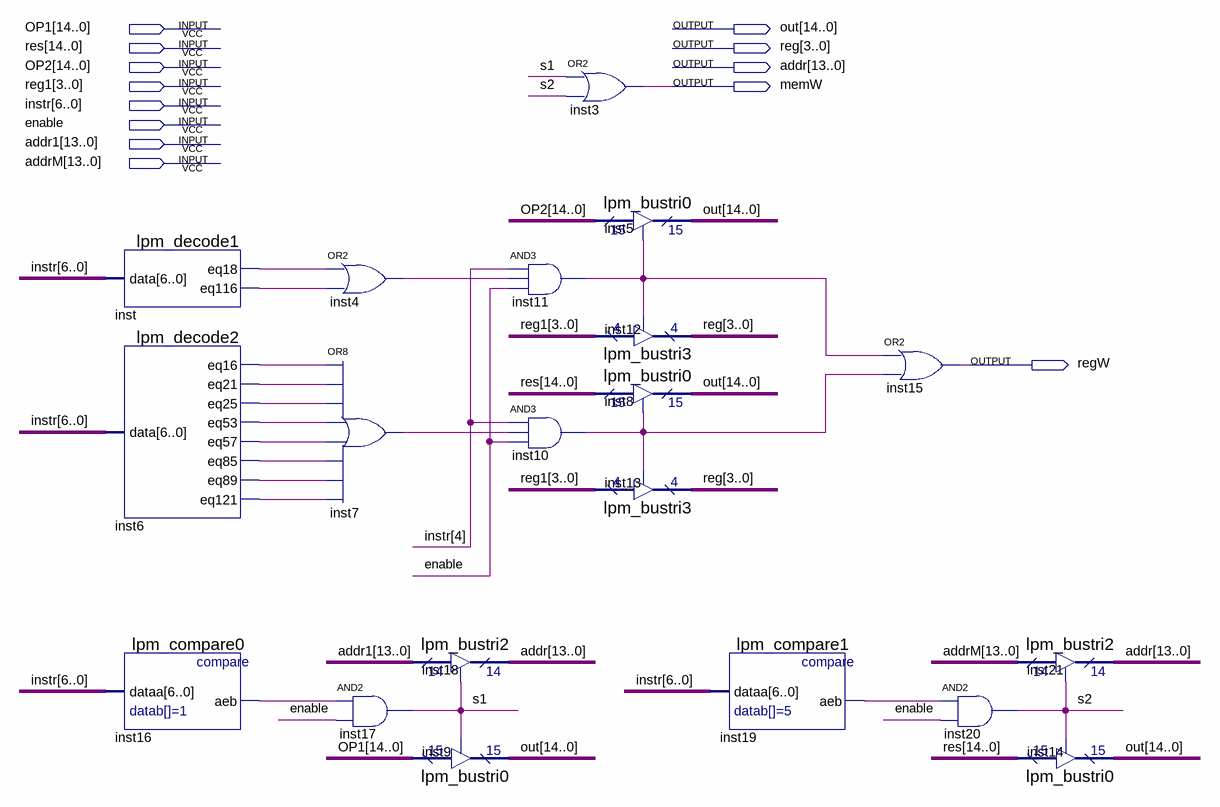
[diagram p0: schematic sheet]
// Quartus schematic saveRes.bdf as structural Verilog: 20 symbols, 13 pins
module saveRes (
  input  [14:0] OP1,
  input  [14:0] res,
  input  [14:0] OP2,
  input  [3:0] reg1,
  input  [6:0] instr,
  input  enable,
  input  [13:0] addr1,
  input  [13:0] addrM,
  output [14:0] out,
  output [3:0] \reg ,
  output [13:0] addr,
  output memW,
  output regW
);

  wire inst4_out, inst6_eq16, inst6_eq21, inst6_eq25, inst6_eq53, inst6_eq57, inst6_eq85, inst6_eq89,
       inst6_eq121, inst7_out, inst10_out, inst11_out, inst16_aeb, inst19_aeb, inst_eq18, inst_eq116, s1, s2;

  lpm_decode1 inst (.data(instr), .eq18(inst_eq18), .eq116(inst_eq116));
  lpm_decode2 inst6 (
    .data(instr), .eq16(inst6_eq16), .eq21(inst6_eq21), .eq25(inst6_eq25), .eq53(inst6_eq53),
    .eq57(inst6_eq57), .eq85(inst6_eq85), .eq89(inst6_eq89), .eq121(inst6_eq121));
  lpm_compare0 inst16 (.dataa(instr), .aeb(inst16_aeb));
  or inst4 (inst4_out, inst_eq18, inst_eq116);
  or inst7 (inst7_out, inst6_eq16, inst6_eq21, inst6_eq25, inst6_eq53, inst6_eq57, inst6_eq85, inst6_eq89, inst6_eq121);
  and inst17 (s1, inst16_aeb, enable);
  lpm_bustri2 inst18 (.enabledt(s1), .data(addr1), .tridata(addr));
  lpm_bustri0 inst9 (.enabledt(s1), .data(OP1), .tridata(out));
  and inst11 (inst11_out, instr[4], inst4_out, enable);
  and inst10 (inst10_out, instr[4], inst7_out, enable);
  or inst3 (memW, s1, s2);
  lpm_bustri0 inst5 (.enabledt(inst11_out), .data(OP2), .tridata(out));
  lpm_bustri3 inst12 (.enabledt(inst11_out), .data(reg1), .tridata(\reg ));
  lpm_bustri0 inst8 (.enabledt(inst10_out), .data(res), .tridata(out));
  lpm_bustri3 inst13 (.enabledt(inst10_out), .data(reg1), .tridata(\reg ));
  lpm_compare1 inst19 (.dataa(instr), .aeb(inst19_aeb));
  or inst15 (regW, inst11_out, inst10_out);
  and inst20 (s2, inst19_aeb, enable);
  lpm_bustri2 inst21 (.enabledt(s2), .data(addrM), .tridata(addr));
  lpm_bustri0 inst14 (.enabledt(s2), .data(res), .tridata(out));
endmodule
